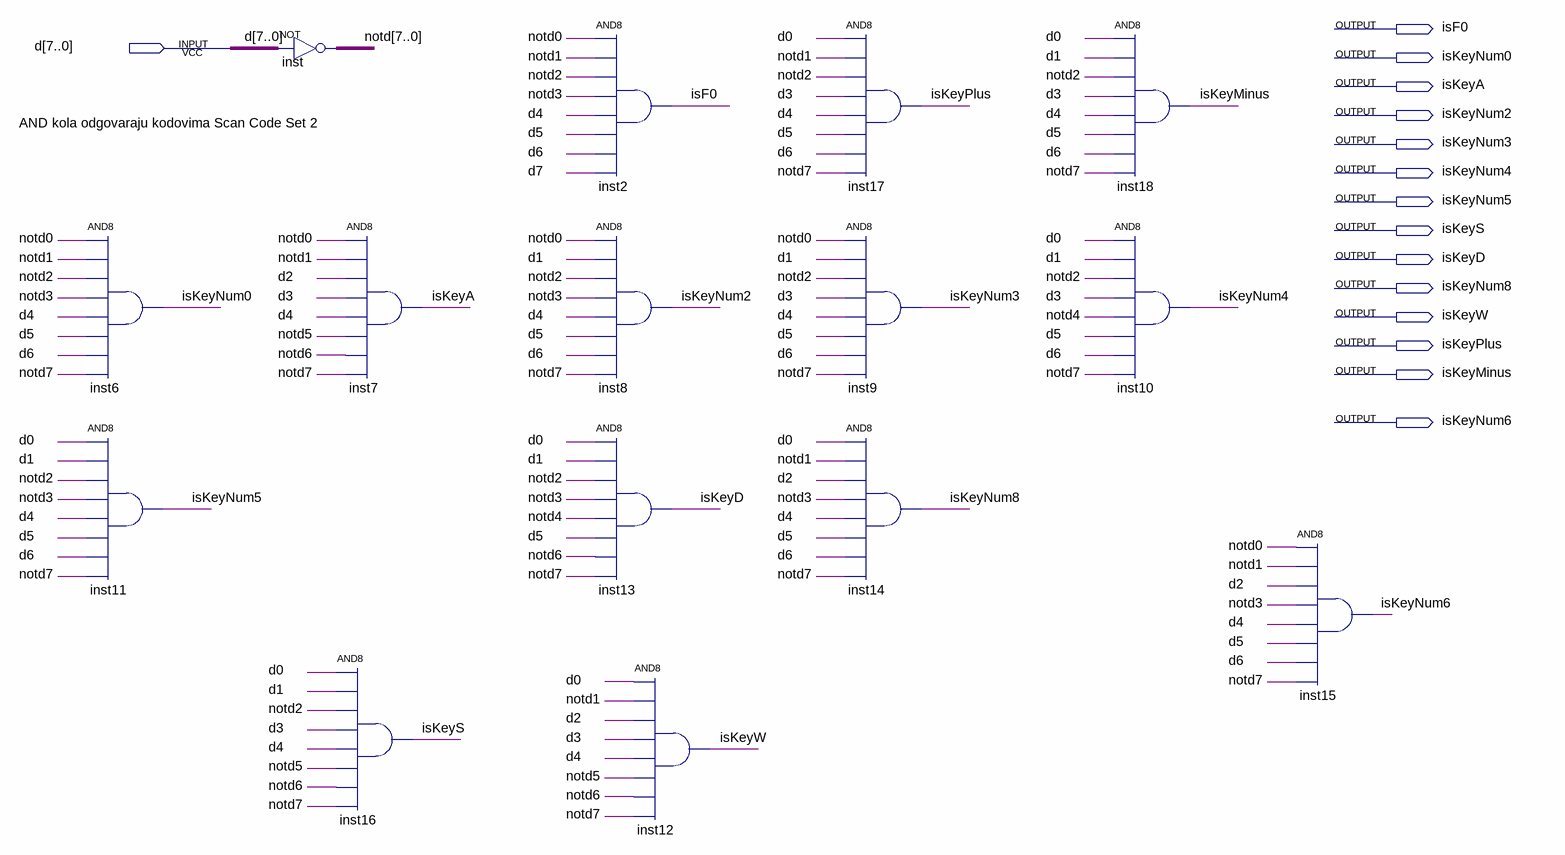
[diagram p0: schematic sheet]
// Quartus schematic KeyDetector.bdf as structural Verilog: 15 symbols, 15 pins
module KeyDetector (
  input  [7:0] d,
  output isF0,
  output isKeyNum0,
  output isKeyA,
  output isKeyNum2,
  output isKeyNum3,
  output isKeyNum4,
  output isKeyNum5,
  output isKeyS,
  output isKeyD,
  output isKeyNum8,
  output isKeyW,
  output isKeyPlus,
  output isKeyMinus,
  output isKeyNum6
);

  wire [7:0] notd;

  and inst6 (isKeyNum0, notd[0], notd[1], notd[2], notd[3], d[4], d[5], d[6], notd[7]);
  and inst11 (isKeyNum5, d[0], d[1], notd[2], notd[3], d[4], d[5], d[6], notd[7]);
  assign notd = ~d;  // NOT inst, 8 bits wide
  and inst7 (isKeyA, notd[0], notd[1], d[2], d[3], d[4], notd[5], notd[6], notd[7]);
  and inst16 (isKeyS, d[0], d[1], notd[2], d[3], d[4], notd[5], notd[6], notd[7]);
  and inst2 (isF0, notd[0], notd[1], notd[2], notd[3], d[4], d[5], d[6], d[7]);
  and inst8 (isKeyNum2, notd[0], d[1], notd[2], notd[3], d[4], d[5], d[6], notd[7]);
  and inst13 (isKeyD, d[0], d[1], notd[2], notd[3], notd[4], d[5], notd[6], notd[7]);
  and inst12 (isKeyW, d[0], notd[1], d[2], d[3], d[4], notd[5], notd[6], notd[7]);
  and inst17 (isKeyPlus, d[0], notd[1], notd[2], d[3], d[4], d[5], d[6], notd[7]);
  and inst9 (isKeyNum3, notd[0], d[1], notd[2], d[3], d[4], d[5], d[6], notd[7]);
  and inst14 (isKeyNum8, d[0], notd[1], d[2], notd[3], d[4], d[5], d[6], notd[7]);
  and inst18 (isKeyMinus, d[0], d[1], notd[2], d[3], d[4], d[5], d[6], notd[7]);
  and inst10 (isKeyNum4, d[0], d[1], notd[2], d[3], notd[4], d[5], d[6], notd[7]);
  and inst15 (isKeyNum6, notd[0], notd[1], d[2], notd[3], d[4], d[5], d[6], notd[7]);

  // Notes on the sheet:
  //   AND kola odgovaraju kodovima Scan Code Set 2
endmodule
